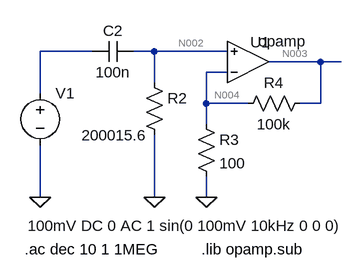
[diagram p0: schematic schema 1.4 Luca Fantin 2000156.asc]
schema 1.4 Luca Fantin 2000156.asc, the LTspice schematic file:
Version 4
SHEET 1 880 680
WIRE 112 -16 32 -16
WIRE 208 -16 176 -16
WIRE 320 -16 208 -16
WIRE 464 0 384 0
WIRE 496 0 464 0
WIRE 320 16 288 16
WIRE 208 32 208 -16
WIRE 32 48 32 -16
WIRE 288 64 288 16
WIRE 352 64 288 64
WIRE 464 64 464 0
WIRE 464 64 432 64
WIRE 288 96 288 64
WIRE 32 208 32 128
WIRE 208 208 208 112
WIRE 288 208 288 176
FLAG 32 208 0
FLAG 208 208 0
FLAG 288 208 0
SYMBOL voltage 32 32 R0
WINDOW 3 -19 220 Left 2
WINDOW 123 24 72 Left 2
WINDOW 39 0 0 Left 0
SYMATTR Value 100mV DC 0 AC 1 sin(0 100mV 10kHz 0 0 0)
SYMATTR InstName V1
SYMBOL cap 176 -32 R90
WINDOW 0 0 32 VBottom 2
WINDOW 3 32 32 VTop 2
SYMATTR InstName C2
SYMATTR Value 100n
SYMBOL res 192 16 R0
WINDOW 3 5 97 Right 2
SYMATTR Value 200015.6
SYMATTR InstName R2
SYMBOL res 272 80 R0
SYMATTR InstName R3
SYMATTR Value 100
SYMBOL res 448 48 R90
WINDOW 0 0 56 VBottom 2
WINDOW 3 32 56 VTop 2
SYMATTR InstName R4
SYMATTR Value 100k
SYMBOL OpAmps\\opamp 352 64 M180
WINDOW 0 4 94 Left 2
SYMATTR InstName U1
TEXT 8 288 Left 2 !.ac dec 10 1 1MEG
TEXT 280 288 Left 2 !.lib opamp.sub

The netlist it stands for:
* schema 1.4 Luca Fantin 2000156.asc
V1 N001 0 100mV DC 0 AC 1 sin(0 100mV 10kHz 0 0 0)
C2 N002 N001 100n
R2 N002 0 200015.6
R3 N004 0 100
R4 N003 N004 100k
XU1 N004 N002 N003 opamp Aol=100K GBW=10Meg  ; pins invin noninvin out
.ac dec 10 1 1MEG
.lib opamp.sub
.backanno
.end

* Results of the author's LTspice run, read from the files saved beside the schematic
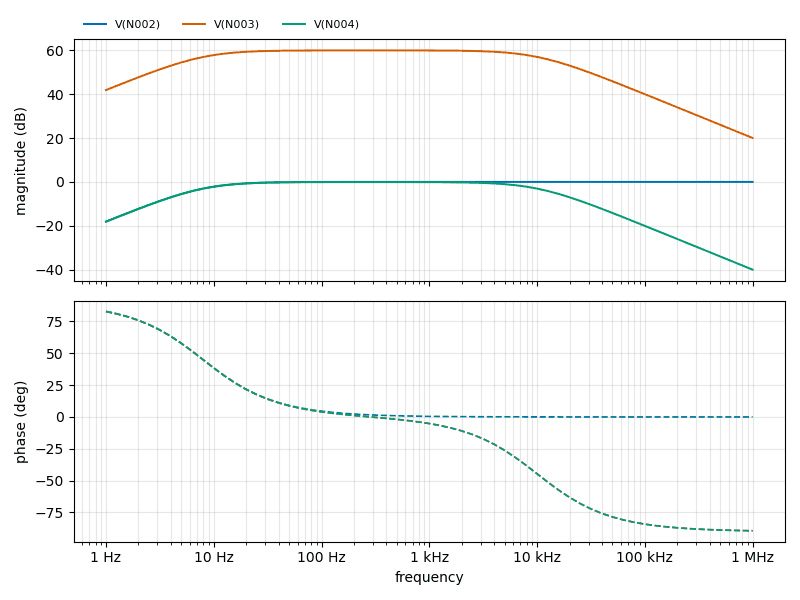
[diagram p1: AC Analysis of schema 1.4 Luca Fantin 2000156.asc, plotted from the saved traces]
* AC Analysis, 1 run:
*   V(N002): -18.08 dB at 1 Hz, -0.00 dB at 1 MHz, peak -0.00 dB at 1 MHz, 3 dB below the peak at 7.959 Hz
*   V(N003): 41.84 dB at 1 Hz, 20.00 dB at 1 MHz, peak 59.92 dB at 316.2 Hz, 3 dB below the peak at 7.944 Hz and 10.1 kHz
*   V(N004): -18.17 dB at 1 Hz, -40.01 dB at 1 MHz, peak -0.09 dB at 316.2 Hz, 3 dB below the peak at 7.944 Hz and 10.1 kHz